# EAGLE design B4_FM_-X_SOLAR_PANEL_v2 (EAGLE 9.2.0)
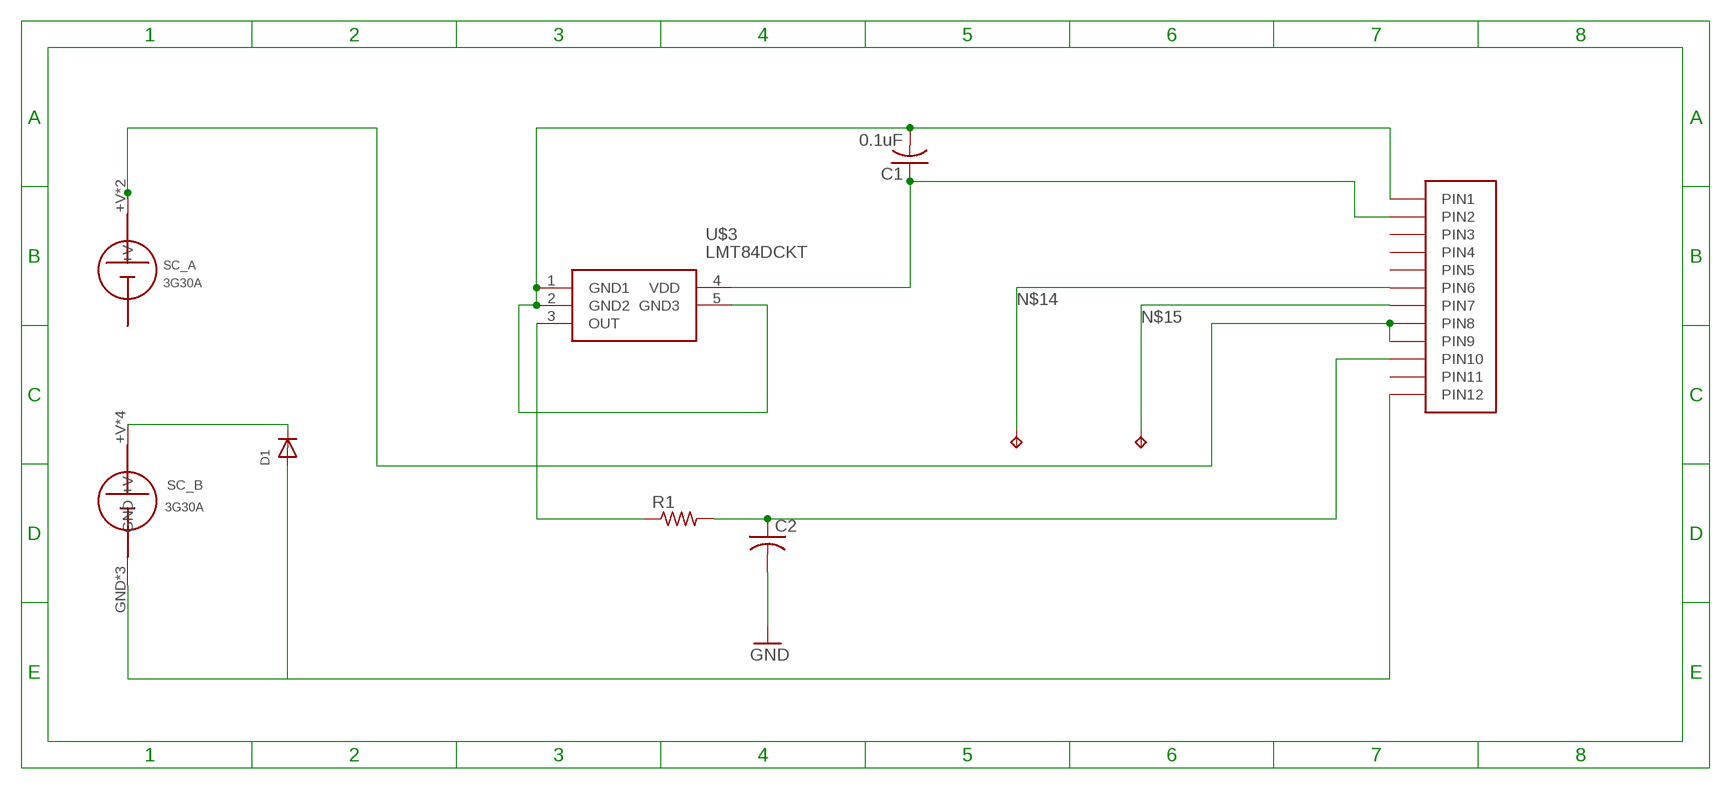
[diagram p0: schematic, sheet 1]

## Parts
C1  0.1uF  C-USC0805  [C0805]
C2  C-USC0805  [C0805]
D1  DIODE_SOD-123FL  [SOD-123FL]
R1  R-US_R0402  [R0402]
SDA1  S1751-46R  [S1751-46R]
SDA3  S1751-46R  [S1751-46R]
SOLARCELL_A  SC_A  [SC_A]
SOLARCELL_B  SC_B  [SC_B]
U$1  HEADER12PIN  [HEADER12PIN]
U$3  LMT84DCKT  [SOT65P210X110-5N]

## Nets
+V: SOLARCELL_A.+V SOLARCELL_A.+V1(+V) U$1.P8(PIN8) U$1.P9(PIN9)
+VB: D1.C SOLARCELL_B.+V SOLARCELL_B.+V2(+V) SOLARCELL_B.+V3(+V) SOLARCELL_B.+V4(+V)
GND: C1.2 C2.2 D1.A SOLARCELL_B.GND SOLARCELL_B.GND1(GND) SOLARCELL_B.GND2(GND) U$1.P1(PIN1) U$1.P12(PIN12) U$3.1(GND1) U$3.2(GND2) U$3.5(GND3)
N$2: R1.1 U$3.3(OUT)
N$5: C1.1 U$1.P2(PIN2) U$3.4(VDD)
N$10: C2.1 R1.2 U$1.P10(PIN10)
N$14: SDA1.P$1(TP) U$1.P6(PIN6)
N$15: SDA3.P$1(TP) U$1.P7(PIN7)
Unconnected: U$1.P3(PIN3) U$1.P4(PIN4) U$1.P5(PIN5) U$1.P11(PIN11)

## Library data of the parts
C1 C2 = adafruit:C-US: CAPACITOR, American symbol
D1 = adafruit:DIODE: Diode SMADIODE - SMA Surface Mount Package 20V 1A Schottky Diode Digikey: 641-1014-6-ND DO-1N4148 - Through Hole Small Current Diode SOD-123 20V 1 A (.5mV Vf) Schottky Diode - Digikey: MBRX120TPMSCT-ND SOD-323 10V 570mA (.38mV Vf, 3ns) Schottky Diode - Digikey: ZLLS410CT-ND SOD-523 30V 30mA Schottky Diode (RB751S-40TE61) - Digikey: RB751S-40TE61CT-ND SOT23-R/W - SOT23 Package (R = Solder Paste/Reflow Ovens, W = Hand-Soldering) BAT54Film 40V 300mA - Digikey: 497-7162-1-ND
R1 = adafruit:R-US_: RESISTOR, American symbol
SDA1 SDA3 = BIRDS3_MSN_BRD_II:S1751-46R
SOLARCELL_A = SC_A:SC_A
SOLARCELL_B = SC_B-2:SC_B
U$1 = BIRDS:HEADER12PIN
U$3 = LMT84DCKT:LMT84DCKT: 1.5V-Capable, 10 uA Analog Output Temperature Sensor in SC70 and TO-92 Source: Datasheet <http://uk.rs-online.com/web/p/products/8115860>; DESCRIPTION: 1.5V-Capable, 10 uA Analog Output Temperature Sensor in SC70 and TO-92; HEIGHT: 1.1mm; MANUFACTURER_NAME: Texas Instruments; MANUFACTURER_PART_NUMBER: LMT84DCKT; RS_PART_NUMBER: 8115860

## Board
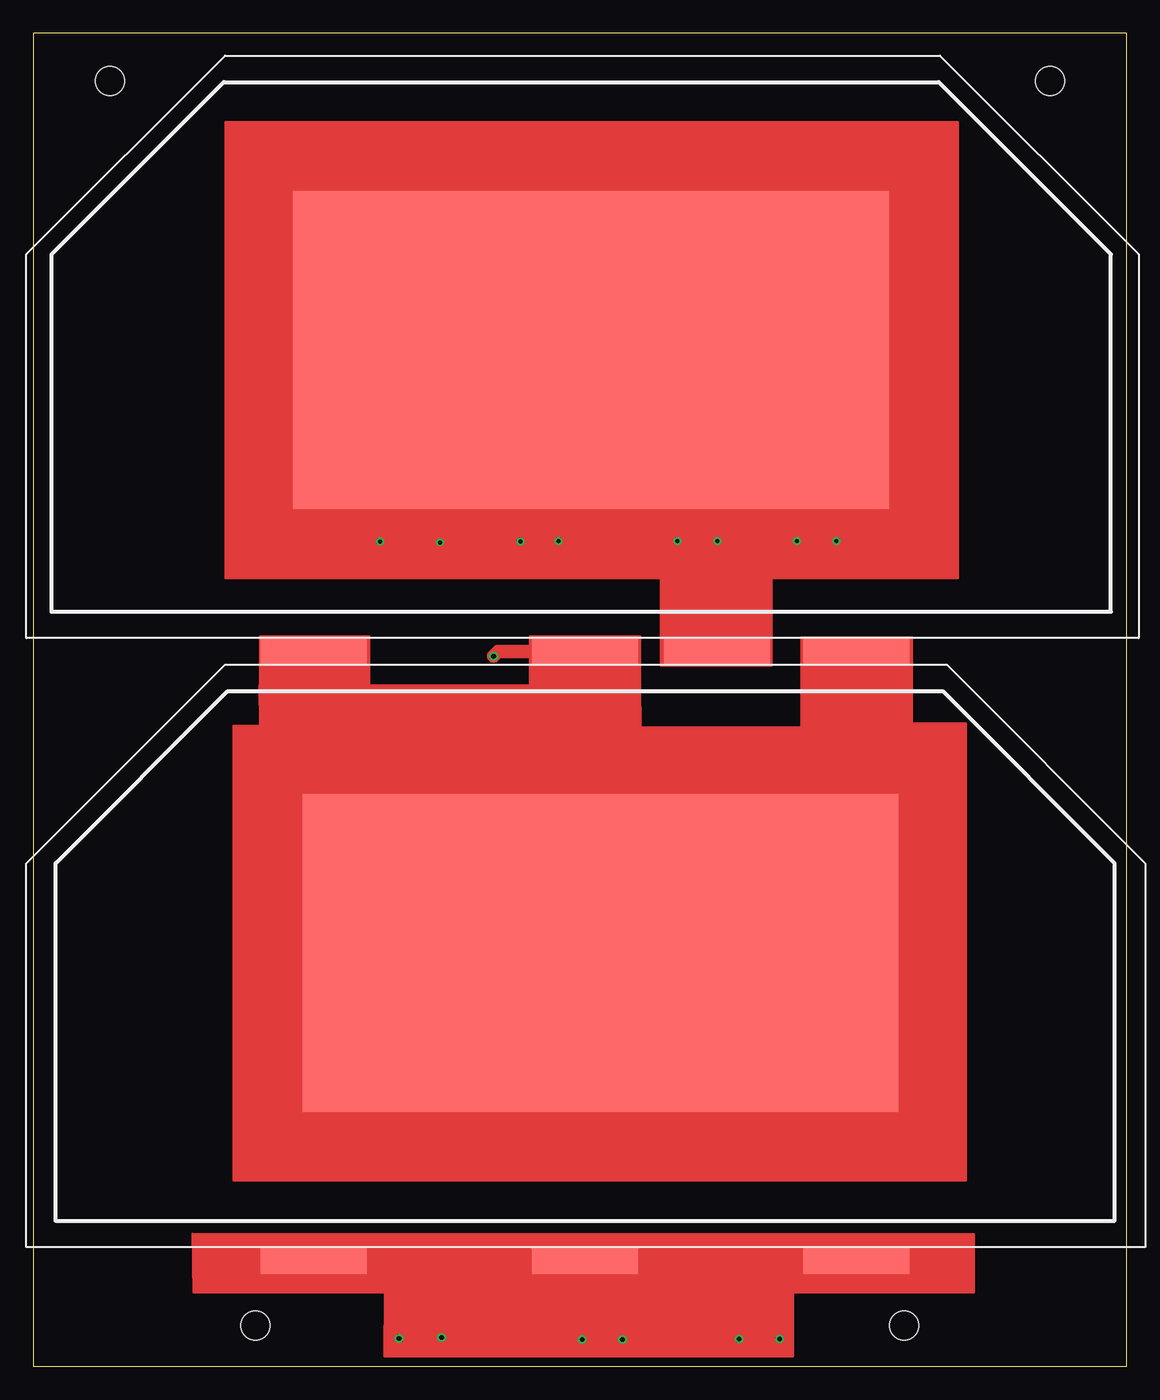
[diagram p1: board, top side]
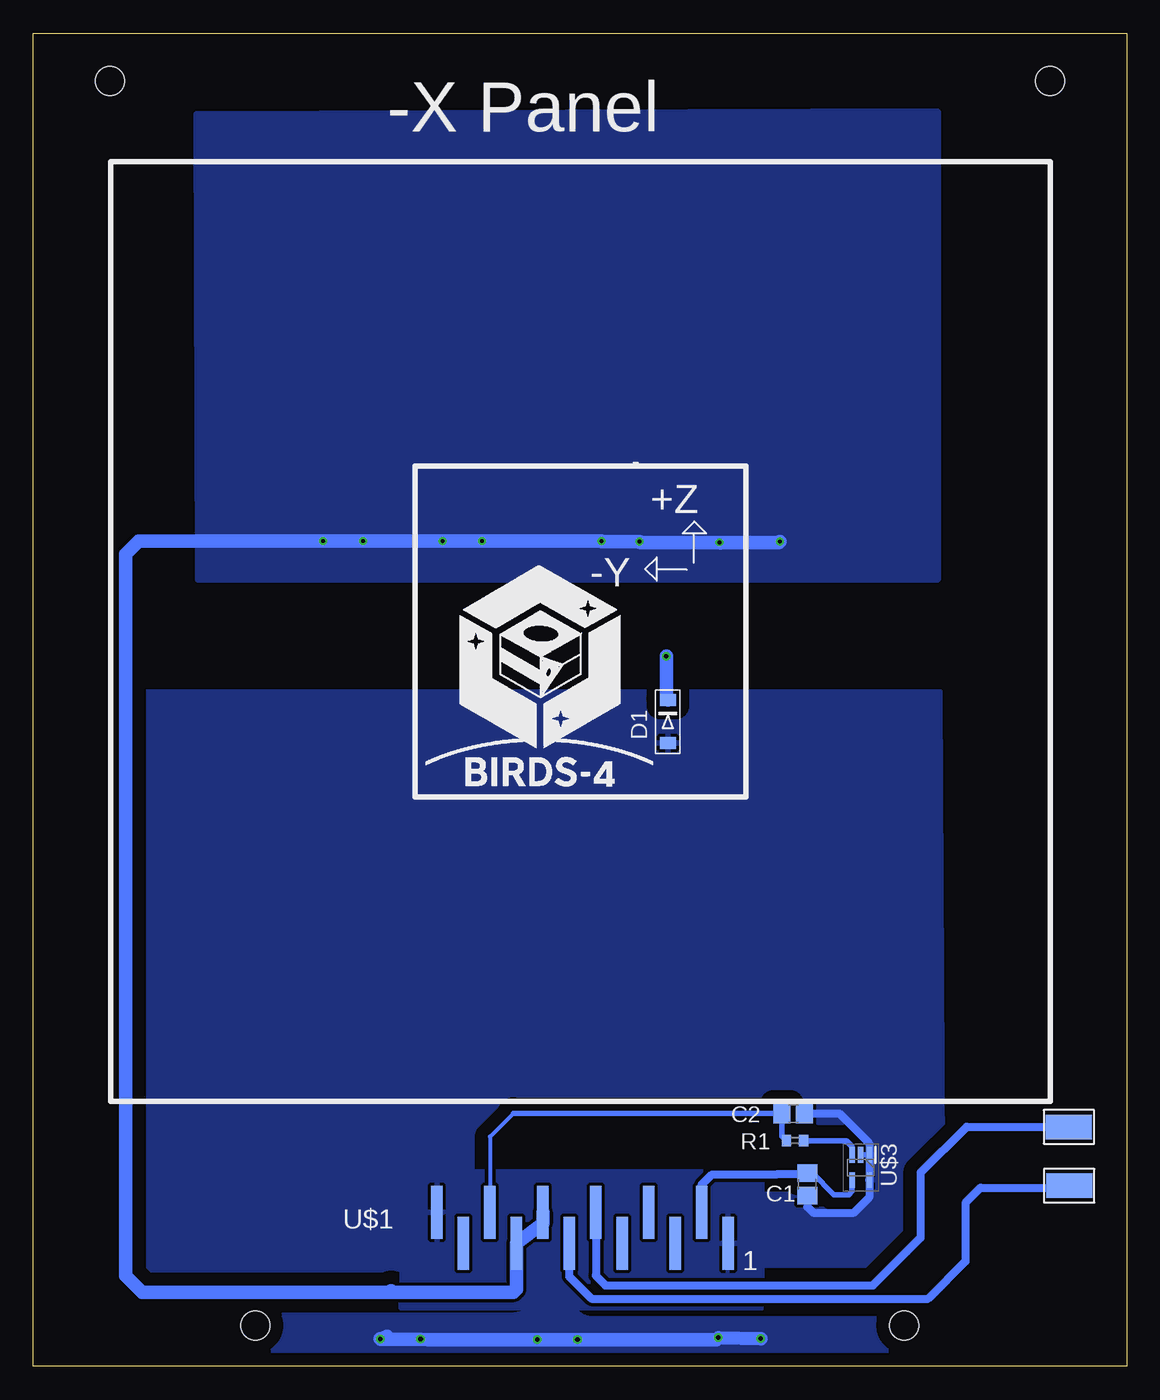
[diagram p2: board, bottom side, seen from below]

Size 82.6 x 100.7 mm. Coordinates in mm from the lower left corner, seen from the top.
Outline: 0,0 82.6,0 82.6,100.7 0,100.7 0,0
Copper layers (1*16): Top 0.035mm / dielectric 1.53mm / Bottom 0.035mm
Design rules "pban_5mil-l2": minimum track width 5mil, minimum drill 0.3mm, track to track 5mil, track to pad 0.229mm, pad to pad 5mil, via to via 5mil, smd to smd 5mil, copper to edge 0.5mm, drill to drill 0.5mm, minimum pad ring 0.15mm, minimum via ring 0.15mm, stop-mask expansion 4mil, vias tented up to drill 0.35mm, thermal gap 10mil
Holes 2.2 mm at 16.8,3.1 65.8,3.1 5.8,97.1 76.8,97.1

### Footprints (pad centres in the part's own frame; a part is rotated, then mirrored left to right if it is on the bottom)
C0805 = smd 1.3 x 1.5: 1 -0.85,0; 2 0.85,0
SOD-123FL = smd 0.91 x 1.22 bottom: A 1.637,0; C -1.637,0
R0402 = smd 0.7 x 0.9: 1 -0.65,0; 2 0.65,0
S1751-46R = smd 3.45 x 1.85: P$1 0,0
SC_A = smd 45 x 24: +V 40.75,19.75 | smd 8 x 2: +V1 50.25,-3
SC_B = smd 45 x 24: +V 41.14,20.22 | smd 8 x 2: +V2 19.5,43; +V3 40,43; +V4 60.5,43; GND 60.5,-3; GND1 19.5,-3; GND2 40,-3
HEADER12PIN = smd 4 x 0.89: P1 0,0; P2 2.35,2; P3 0,4; P4 2.35,6; P5 0,8; P6 2.35,10; P7 0,12; P8 2.35,14; P9 0,16; P10 2.35,18; P11 0,20; P12 2.35,22
SOT65P210X110-5N = smd 1.2 x 0.4: 1 -0.95,0.65; 2 -0.95,0; 3 -0.95,-0.65; 4 0.95,-0.65; 5 0.95,0.65

### Placement (x,y rotation side)
C1  24.12,13.76 270 bottom
C2  25.18,19.1 0 bottom
D1  34.66,48.71 270 top
R1  25.05,17.06 180 bottom
SDA1  4.37,18.09 0 bottom
SDA3  4.34,13.65 0 bottom
SOLARCELL_A  1.4,57 0 top
SOLARCELL_B  1.7,11 0 top
U$1  30.1,9.3 90 bottom
U$3  20.09,15.02 270 bottom

### Tracks (layer width: path | path; a pad name or v marks a point on that pad's centre or on a via)
+V  (via drill 0.3)
  Top 0.152: 33.68,62.33 v36.81,62.31
  Top 0.406: SOLARCELL_A.+V 42.15,72.87 51.43,63.59 51.43,54.22 SOLARCELL_A.+V1 51.65,60.99 49.51,63.13 34.96,63.13 33.68,62.33
  Bottom 0.61: 60.74,62.39 v60.68,62.33
  Bottom 1.016: 30.69,62.18 v30.75,62.24 | v30.75,62.24 26.26,62.24 v26.2,62.3 | v30.75,62.24 36.74,62.24 v36.81,62.31 39.66,62.31 v39.68,62.33 v48.68,62.33 v51.68,62.33 v57.68,62.33 v60.68,62.33 74.62,62.33 75.61,61.34 75.61,6.86 74.36,5.61 55.66,5.61 | 44.07,11.18 U$1.P8 44.1,10.8 U$1.P9 46.1,5.81 46.3,5.61 55.66,5.61 | 55.66,5.61 55.55,5.72
  pour Bottom (isolate 1.016): 14.6,94.71 70.22,94.5 70.1,59.5 14.3,59.5 14.3,94.7
+VB  (via drill 0.35)
  Top 1.016: SOLARCELL_B.+V3 arc-90 32.09,44.39 25.15,44.39 arc-90 21.2,48.34 SOLARCELL_B.+V2 | SOLARCELL_B.+V3 arc-90 41.78,53.92 41.78,41.32 | 41.78,41.32 arc-90 44.22,43.76 62.87,43.76 arc-90 62.2,44.44 SOLARCELL_B.+V4 | SOLARCELL_B.+V arc-90 41.88,32.19 41.88,40.81 arc-90 41.78,40.91 41.78,41.32 | SOLARCELL_B.+V3 35.13,54 v34.78,53.64
  Bottom 1.016: v34.78,53.64 34.78,50.47 D1.C
GND  (via drill 0.35)
  Top 1.016: v30.85,2.17 30.85,8.66 30.09,8.66 | 30,8.66 30.09,8.66 | 30.09,8.66 30.09,8.71 21.2,8.71 SOLARCELL_B.GND1 | v41.48,2.02 41.48,8 SOLARCELL_B.GND2 SOLARCELL_B.GND 55.99,8 v56.38,2.08
  Bottom 0.406: U$3.2 U$3.1
  Bottom 0.61: C2.2 21.71,19.1 19.44,16.83 U$3.1 U$3.5 19.44,12.76 20.6,11.6 23.68,11.6 24.12,12.04 C1.2 | U$1.P1 30.25,8.95 30.14,8.84
  Bottom 1.016: 55.84,2.28 v56.38,2.08 56.36,2.06 v53.33,2.06 52.78,2.02 v44.52,2.02 v44.51,2.02 v41.48,2.02 31,2.02 v30.85,2.17 v27.64,2.1
  pour Bottom (isolate 1): 14.1,50.92 76,50.92 75.76,1.12 13.86,1.12
  pour Bottom (isolate 0.254): 27.48,14.74 54.82,14.74 54.82,6.15 54.87,4.4 29.74,4.4 27.51,4.4 27.48,4.65
N$2
  Bottom 0.406: U$3.3 20.74,16.63 21.16,17.05 R1.1
N$5
  Bottom 0.406: U$3.4 20.74,13.21 20.99,12.96 22.11,12.96 23.76,14.61 C1.1
  Bottom 0.61: 32.15,11.2 U$1.P2 32.1,13.72 31.32,14.5 28.25,14.5 26.47,14.5 | 26.47,14.5 | C1.1 24.23,14.5 26.47,14.5
N$10
  Bottom 0.305: U$1.P10 48.1,17.34 46.31,19.13
  Bottom 0.406: 46.31,19.13 25.93,19.13 | R1.2 26.03,17.39 C2.1
  Bottom 0.61: 25.76,17.12 R1.2 | C2.1 26.01,19.13 25.93,19.13
N$14
  Bottom 0.202: 40.21,11.04 U$1.P6 40.32,10.93 | 16.59,8.62 16.59,8.68
  Bottom 0.61: U$1.P6 40.1,6.85 39.37,6.12 19.15,6.12 16.59,8.68 15.57,9.7 15.57,14.62 12.09,18.1 SDA1.P$1
N$15
  Bottom 0.61: SDA3.P$1 4.5,13.49 11.04,13.49 12.18,12.35 12.18,7.92 14.98,5.12 40.44,5.12 42.1,6.78 U$1.P7

### Text on the board
bPlace: -X Panel | +Z | -Y
bNames: U$1 | 1